# EAGLE design r202smt (EAGLE 6.6.0)
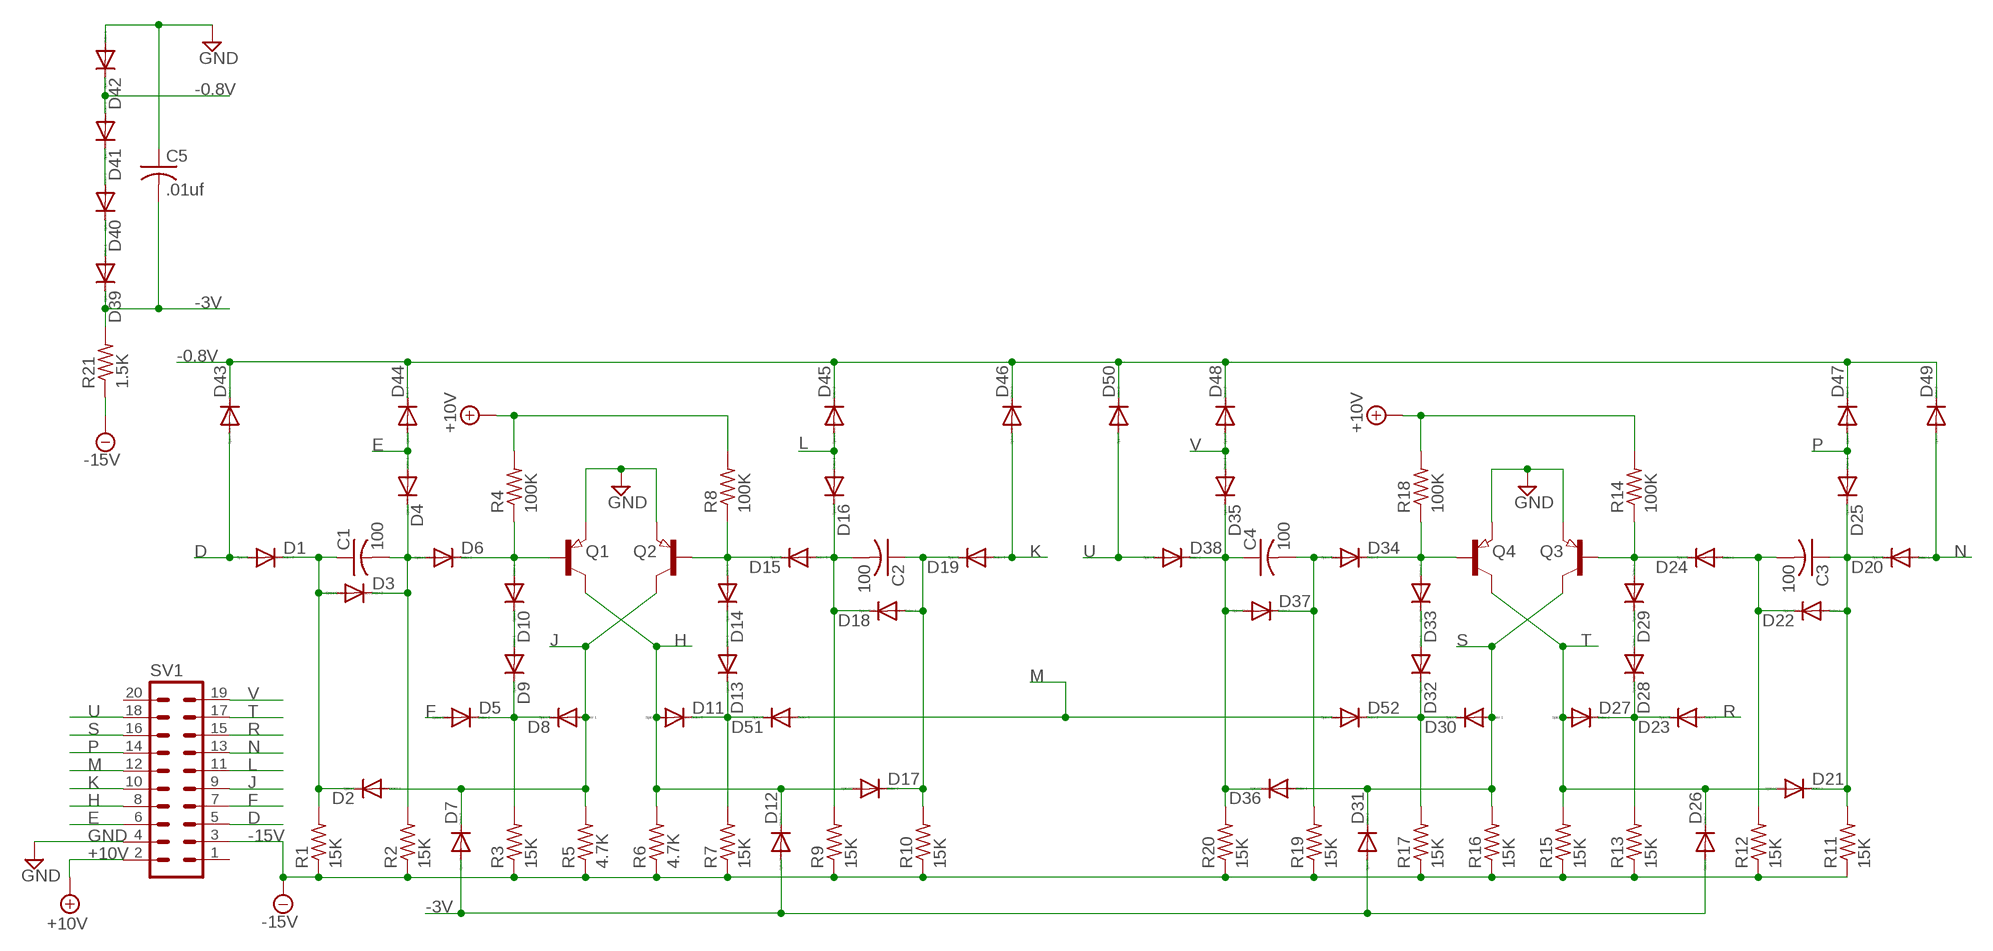
[diagram p0: schematic, sheet 1]

## Parts
C1  100  C-USC0603  [C0603]
C2  100  C-USC0603  [C0603]
C3  100  C-USC0603  [C0603]
C4  100  C-USC0603  [C0603]
C5  .01uf  C-USC1206  [C1206]
D1  DIODE-SOD110-W  [SOD110-W]
D2  DIODE-SOD110-W  [SOD110-W]
D3  DIODE-SOD110-W  [SOD110-W]
D4  DIODE-SOD110-W  [SOD110-W]
D5  DIODE-SOD110-W  [SOD110-W]
D6  DIODE-SOD110-W  [SOD110-W]
D7  DIODE-SOD110-W  [SOD110-W]
D8  DIODE-SOD110-W  [SOD110-W]
D9  DIODE-SOD110-W  [SOD110-W]
D10  DIODE-SOD110-W  [SOD110-W]
D11  DIODE-SOD110-W  [SOD110-W]
D12  DIODE-SOD110-W  [SOD110-W]
D13  DIODE-SOD110-W  [SOD110-W]
D14  DIODE-SOD110-W  [SOD110-W]
D15  DIODE-SOD110-W  [SOD110-W]
D16  DIODE-SOD110-W  [SOD110-W]
D17  DIODE-SOD110-W  [SOD110-W]
D18  DIODE-SOD110-W  [SOD110-W]
D19  DIODE-SOD110-W  [SOD110-W]
D20  DIODE-SOD110-W  [SOD110-W]
D21  DIODE-SOD110-W  [SOD110-W]
D22  DIODE-SOD110-W  [SOD110-W]
D23  DIODE-SOD110-W  [SOD110-W]
D24  DIODE-SOD110-W  [SOD110-W]
D25  DIODE-SOD110-W  [SOD110-W]
D26  DIODE-SOD110-W  [SOD110-W]
D27  DIODE-SOD110-W  [SOD110-W]
D28  DIODE-SOD110-W  [SOD110-W]
D29  DIODE-SOD110-W  [SOD110-W]
D30  DIODE-SOD110-W  [SOD110-W]
D31  DIODE-SOD110-W  [SOD110-W]
D32  DIODE-SOD110-W  [SOD110-W]
D33  DIODE-SOD110-W  [SOD110-W]
D34  DIODE-SOD110-W  [SOD110-W]
D35  DIODE-SOD110-W  [SOD110-W]
D36  DIODE-SOD110-W  [SOD110-W]
D37  DIODE-SOD110-W  [SOD110-W]
D38  DIODE-SOD110-W  [SOD110-W]
D39  DIODE-SOD110-W  [SOD110-W]
D40  DIODE-SOD110-W  [SOD110-W]
D41  DIODE-SOD110-W  [SOD110-W]
D42  DIODE-SOD110-W  [SOD110-W]
D43  DIODE-SOD110-W  [SOD110-W]
D44  DIODE-SOD110-W  [SOD110-W]
D45  DIODE-SOD110-W  [SOD110-W]
D46  DIODE-SOD110-W  [SOD110-W]
D47  DIODE-SOD110-W  [SOD110-W]
D48  DIODE-SOD110-W  [SOD110-W]
D49  DIODE-SOD110-W  [SOD110-W]
D50  DIODE-SOD110-W  [SOD110-W]
D51  DIODE-SOD110-W  [SOD110-W]
D52  DIODE-SOD110-W  [SOD110-W]
Q1  PNP-TRANSISTOR_SOT23  [SOT23]
Q2  PNP-TRANSISTOR_SOT23  [SOT23]
Q3  PNP-TRANSISTOR_SOT23  [SOT23]
Q4  PNP-TRANSISTOR_SOT23  [SOT23]
R1  15K  R-US_R0603  [R0603]
R2  15K  R-US_R0603  [R0603]
R3  15K  R-US_R0603  [R0603]
R4  100K  R-US_R0603  [R0603]
R5  4.7K  R-US_R0603  [R0603]
R6  4.7K  R-US_R0603  [R0603]
R7  15K  R-US_R0603  [R0603]
R8  100K  R-US_R0603  [R0603]
R9  15K  R-US_R0603  [R0603]
R10  15K  R-US_R0603  [R0603]
R11  15K  R-US_R0603  [R0603]
R12  15K  R-US_R0603  [R0603]
R13  15K  R-US_R0603  [R0603]
R14  100K  R-US_R0603  [R0603]
R15  15K  R-US_R0603  [R0603]
R16  15K  R-US_R0603  [R0603]
R17  15K  R-US_R0603  [R0603]
R18  100K  R-US_R0603  [R0603]
R19  15K  R-US_R0603  [R0603]
R20  15K  R-US_R0603  [R0603]
R21  1.5K  R-US_R1206  [R1206]
SV1  MA10-2W  [MA10-2W]

## Nets
+10V: R4.2 R8.2 R14.2 R18.2 SV1.2
-0.8V: D41.A D42.C D43.C D44.C D45.C D46.C D47.C D48.C D49.C D50.C
-3V: C5.2 D7.A D12.A D26.A D31.A D39.C R21.2
-15V: R1.1 R2.1 R3.1 R5.1 R6.1 R7.1 R9.1 R10.1 R11.1 R12.1 R13.1 R15.1 R16.1 R17.1 R19.1 R20.1 R21.1 SV1.3
D: D1.A D43.A SV1.5
E: D4.A D44.A SV1.6
F: D5.A SV1.7
GND: C5.1 D42.A Q1.2(E) Q2.2(E) Q3.2(E) Q4.2(E) SV1.4
H: D11.A D12.C D17.A Q1.3(C) R6.2 SV1.8
J: D2.A D7.C D8.A Q2.3(C) R5.2 SV1.9
K: D19.A D46.A SV1.10
L: D16.A D45.A SV1.11
M: D51.A D52.A SV1.12
N: D20.A D49.A SV1.13
N$1: C1.1 D1.C D2.C D3.A R1.2
N$2: D14.A D15.C Q2.1(B) R8.1
N$3: C1.2 D3.C D4.C D6.A R2.2
N$5: C3.2 D22.C D24.A R12.2
N$6: D6.C D10.A Q1.1(B) R4.1
N$7: D9.A D10.C
N$8: C3.1 D20.C D21.C D22.A D25.C R11.2
N$9: D5.C D8.C D9.C R3.2
N$10: D11.C D13.C D51.C R7.2
N$11: C4.1 D35.C D36.C D37.A D38.C R20.2
N$12: D13.A D14.C
N$13: C2.1 D17.C D18.A D19.C R10.2
N$14: C4.2 D34.A D37.C R19.2
N$15: C2.2 D15.A D16.C D18.C R9.2
N$17: D33.A D34.C Q4.1(B) R18.1
N$23: D32.A D33.C
N$24: D30.C D32.C D52.C R17.2
N$25: D23.C D27.C D28.C R13.2
N$26: D24.C D29.A Q3.1(B) R14.1
N$27: D28.A D29.C
N$30: D39.A D40.C
N$31: D40.A D41.C
P: D25.A D47.A SV1.14
R: D23.A SV1.15
S: D30.A D31.C D36.A Q3.3(C) R16.2 SV1.16
T: D21.A D26.C D27.A Q4.3(C) R15.2 SV1.17
U: D38.A D50.A SV1.18
V: D35.A D48.A SV1.19
Unconnected: SV1.1 SV1.20

## Library data of the parts
C1-C5 = rcl:C-US: CAPACITOR, American symbol
D1-D52 = diode:DIODE-: DIODE
Q1-Q4 = semicon-smd-ipc:PNP-TRANSISTOR_: PNP TRANSISTOR
R1-R21 = rcl:R-US_: RESISTOR, American symbol
SV1 = con-lstb:MA10-2W: PIN HEADER; OC_FARNELL: unknown; OC_NEWARK: unknown

## Board
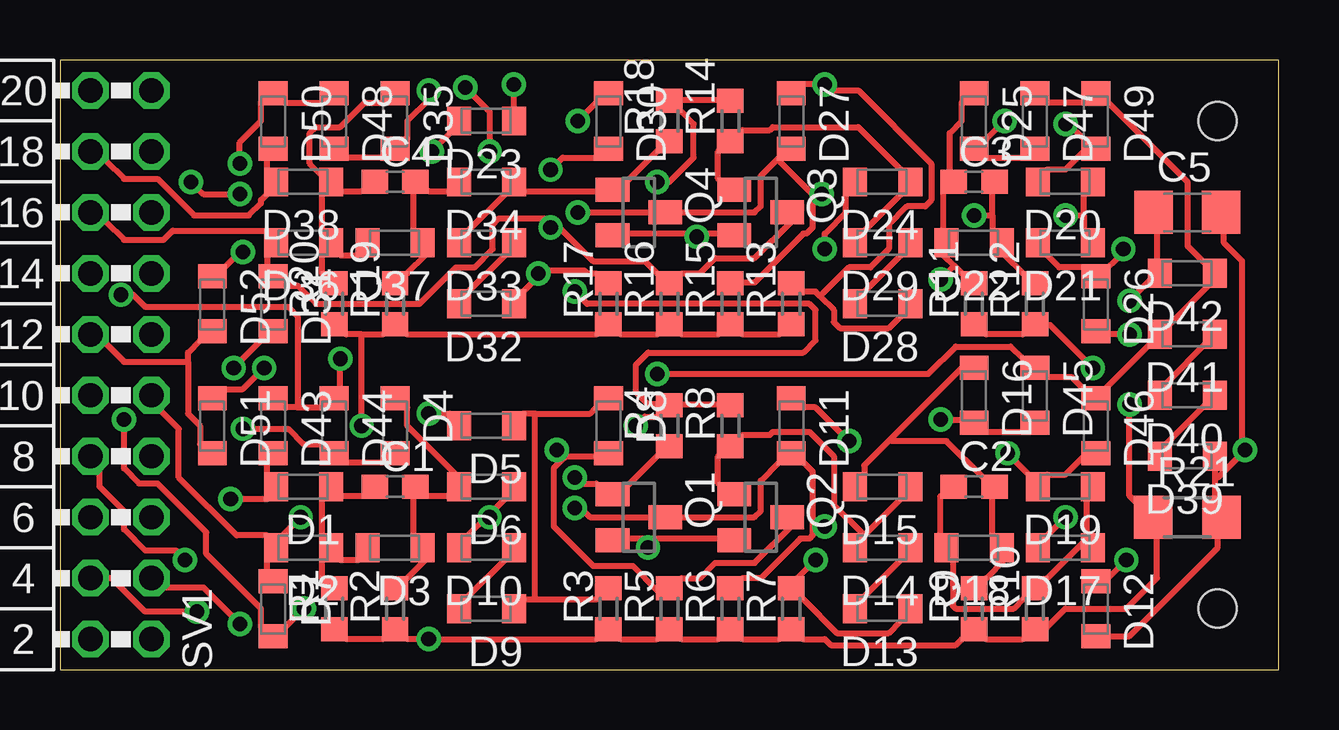
[diagram p1: board, top side]
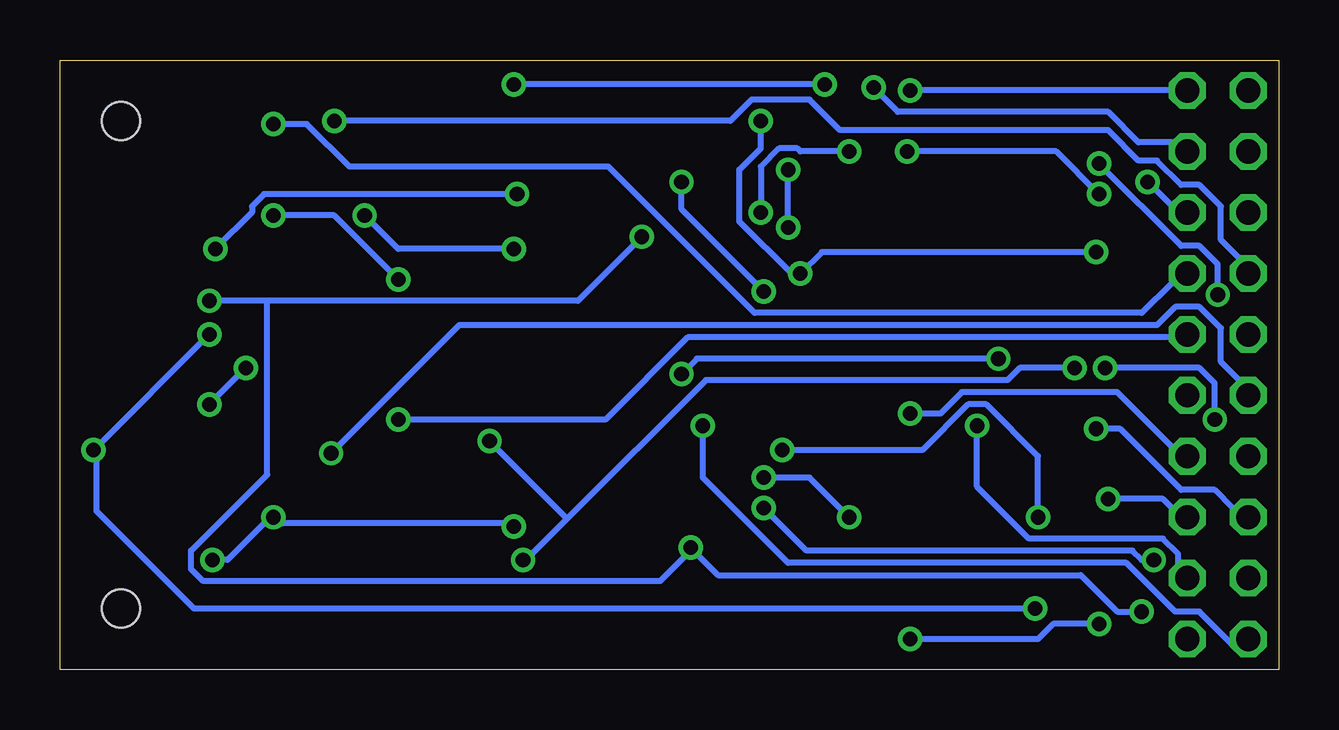
[diagram p2: board, bottom side, seen from below]

Size 50.8 x 25.4 mm. Coordinates in mm from the lower left corner, seen from the top.
Outline: 0,0 50.8,0 50.8,25.4 0,25.4 0,0
Copper layers (1*16): Top 0.035mm / dielectric 1.5mm / Bottom 0.035mm
Design rules "8mils": minimum track width 10mil, minimum drill 24mil, track to track 8mil, track to pad 8mil, pad to pad 8mil, via to via 8mil, smd to smd 8mil, copper to edge 20mil, drill to drill 10mil, minimum pad ring 10mil, minimum via ring 8mil, stop-mask expansion 0mil, vias tented up to drill 0mil, thermal gap 10mil
Holes 1.59 mm at 48.26,22.86 48.26,2.54

### Footprints (pad centres in the part's own frame; a part is rotated, then mirrored left to right if it is on the bottom)
C0603 = smd 1.1 x 1: 1 -0.85,0; 2 0.85,0
C1206 = smd 1.6 x 1.8: 1 -1.4,0; 2 1.4,0
SOD110-W = smd 1 x 1.2: A 1.15,0; C -1.15,0
SOT23 = smd 1 x 1.4: 1 -0.95,-1.1; 2 0.95,-1.1; 3 0,1.1
R0603 = smd 1 x 1.1: 1 -0.85,0; 2 0.85,0
R1206 = smd 1.6 x 1.803: 1 -1.422,0; 2 1.422,0
MA10-2W = drill 1.016 octagon: 1 -11.43,-1.27; 2 -11.43,1.27; 3 -8.89,-1.27; 4 -8.89,1.27; 5 -6.35,-1.27; 6 -6.35,1.27; 7 -3.81,-1.27; 8 -3.81,1.27; 9 -1.27,-1.27; 10 -1.27,1.27; 11 1.27,-1.27; 12 1.27,1.27; 13 3.81,-1.27; 14 3.81,1.27; 15 6.35,-1.27; 16 6.35,1.27; 17 8.89,-1.27; 18 8.89,1.27; 19 11.43,-1.27; 20 11.43,1.27

### Placement (x,y rotation side)
C1  13.97,7.62 0 top
C2  38.1,7.62 0 top
C3  38.1,20.32 0 top
C4  13.97,20.32 0 top
C5  46.99,19.05 0 top
D1  10.16,7.62 180 top
D2  10.16,5.08 180 top
D3  13.97,5.08 180 top
D4  13.97,10.16 270 top
D5  17.78,10.16 180 top
D6  17.78,7.62 180 top
D7  8.89,2.54 270 top
D8  22.86,10.16 270 top
D9  17.78,2.54 180 top
D10  17.78,5.08 180 top
D11  30.48,10.16 270 top
D12  43.18,2.54 270 top
D13  34.29,2.54 180 top
D14  34.29,5.08 180 top
D15  34.29,7.62 180 top
D16  38.1,11.43 270 top
D17  41.91,5.08 180 top
D18  38.1,5.08 180 top
D19  41.91,7.62 180 top
D20  41.91,20.32 180 top
D21  41.91,17.78 180 top
D22  38.1,17.78 180 top
D23  17.78,22.86 180 top
D24  34.29,20.32 180 top
D25  38.1,22.86 270 top
D26  43.18,15.24 270 top
D27  30.48,22.86 270 top
D28  34.29,15.24 180 top
D29  34.29,17.78 180 top
D30  22.86,22.86 270 top
D31  8.89,15.24 270 top
D32  17.78,15.24 180 top
D33  17.78,17.78 180 top
D34  17.78,20.32 180 top
D35  13.97,22.86 270 top
D36  10.16,17.78 180 top
D37  13.97,17.78 180 top
D38  10.16,20.32 180 top
D39  46.99,8.89 180 top
D40  46.99,11.43 180 top
D41  46.99,13.97 180 top
D42  46.99,16.51 180 top
D43  8.89,10.16 270 top
D44  11.43,10.16 270 top
D45  40.64,11.43 270 top
D46  43.18,10.16 270 top
D47  40.64,22.86 270 top
D48  11.43,22.86 270 top
D49  43.18,22.86 270 top
D50  8.89,22.86 270 top
D51  6.35,10.16 270 top
D52  6.35,15.24 270 top
Q1  24.13,6.35 270 top
Q2  29.21,6.35 270 top
Q3  29.21,19.05 270 top
Q4  24.13,19.05 270 top
R1  11.43,2.54 90 top
R2  13.97,2.54 90 top
R3  22.86,2.54 90 top
R4  25.4,10.16 90 top
R5  25.4,2.54 90 top
R6  27.94,2.54 90 top
R7  30.48,2.54 90 top
R8  27.94,10.16 90 top
R9  38.1,2.54 90 top
R10  40.64,2.54 90 top
R11  38.1,15.24 90 top
R12  40.64,15.24 90 top
R13  30.48,15.24 90 top
R14  27.94,22.86 90 top
R15  27.94,15.24 90 top
R16  25.4,15.24 90 top
R17  22.86,15.24 90 top
R18  25.4,22.86 90 top
R19  13.97,15.24 90 top
R20  11.43,15.24 90 top
R21  46.99,6.35 0 top
SV1  2.54,12.7 90 top

### Tracks (layer width: path | path; a pad name or v marks a point on that pad's centre or on a via)
+10V  (via drill 0.61)
  Top 0.254: R14.2 27.43,23.75 25.91,23.75 R18.2 25.91,23.24 26.42,22.73 26.42,21.34 25.4,20.32 v24.89,20.32 | R4.2 25.91,11.05 27.43,11.05 R8.2 | v24,10.16 24.38,10.54 24.89,10.54 R4.2 | v21.46,15.75 21.97,15.24 31.24,15.24 31.5,14.99 31.5,13.72 30.99,13.21 24.51,13.21 24,12.7 24,11.56 24.51,11.05 24.89,11.05 R4.2
  Bottom 0.254: v24,10.16 24,8 20.45,4.45 6.35,4.45 4.32,2.41 3.3,2.41 1.91,1.02 SV1.2 | v24.89,20.32 24.89,19.18 v21.46,15.75
-0.8V  (via drill 0.61)
  Top 0.254: 42.67,23.62 41.15,23.62 D47.C | D49.C 42.67,23.62 | D48.C 10.92,23.62 9.4,23.62 D50.C 8.38,23.62 8.38,22.86 7.49,21.97 v7.49,21.08 | 9.91,10.92 10.92,10.92 D44.C 11.68,11.68 v11.68,12.95 | 9.91,10.92 9.4,10.92 D43.C | v24.89,12.32 36.2,12.32 37.34,13.46 39.62,13.46 40.13,12.95 D45.C 41.15,12.19 42.16,12.19 42.67,11.68 D46.C D41.A 48.14,16.27 D42.C 46.99,17.66 46.99,20.32 43.69,23.62 42.67,23.62 | v2.54,15.62 3.05,15.62 3.56,15.11 9.53,15.11 9.91,14.73 9.91,10.92
  Bottom 0.254: v11.68,12.95 24.26,12.95 v24.89,12.32 | v7.49,21.08 4.06,17.65 3.3,17.65 2.54,16.89 v2.54,15.62
-3V  (via drill 0.61)
  Top 0.254: v2.67,10.41 2.67,8.38 3.3,7.75 4.06,7.75 6.1,5.71 6.1,4.83 8.38,2.54 8.38,1.78 D7.A 9.02,1.4 v10.16,2.54 | v7.24,12.57 8.38,13.72 D31.A | D12.A 44.57,1.39 48.26,5.08 48.26,6.2 R21.2 48.14,6.62 48.14,8 | D39.C 48.14,8 | v44.58,13.97 43.18,13.97 D26.A | 48.14,8 48.26,8 v49.4,9.14 49.28,9.14 49.28,17.02 48.51,17.78 48.51,19.05 C5.2
  Bottom 0.254: v2.67,10.41 2.67,11.94 3.3,12.57 v7.24,12.57 | v44.58,13.97 v49.4,9.14 49.28,9.14 49.28,6.6 45.21,2.54 v10.16,2.54
-15V  (via drill 0.61)
  Top 0.254: 12.57,13.97 13.46,13.97 R19.1 14.48,13.97 22.35,13.97 R17.1 23.37,13.97 24.89,13.97 R16.1 25.91,13.97 27.43,13.97 R15.1 28.45,13.97 29.97,13.97 R13.1 | 12.57,13.97 11.94,13.97 R20.1 | v12.57,10.16 12.57,13.97 | R1.1 11.94,1.27 13.46,1.27 R2.1 14.48,1.27 v15.37,1.27 22.35,1.27 R3.1 23.37,1.27 24.89,1.27 R5.1 25.91,1.27 27.43,1.27 R6.1 28.45,1.27 29.97,1.27 R7.1 30.99,1.27 31.88,1.27 32.13,1.02 37.34,1.02 37.59,1.27 R9.1 38.61,1.27 40.13,1.27 R10.1 41.06,1.69 41.91,2.54 44.45,2.54 45.72,3.81 45.72,6.2 R21.1 45.47,6.35 44.58,7.24 v44.58,11.05 | R11.1 38.61,13.97 40.13,13.97 R12.1 40.64,14.35 41.27,14.35 v43.05,12.57 | v7.49,1.91 5.97,3.43 4.45,3.43 SV1.3
  Bottom 0.254: v12.57,10.16 12.57,7.62 10.41,5.46 4.83,5.46 4.19,4.83 4.19,4.45 SV1.3 | v7.49,1.91 9.4,1.91 10.03,1.27 v15.37,1.27 | v44.58,11.05 v43.05,12.57
D  (via drill 0.61)
  Top 0.254: D43.A 8.64,8.64 8.64,8.13 D1.A 8.64,7.11 v7.11,7.11
  Bottom 0.254: v7.11,7.11 4.83,7.11 4.45,6.73 SV1.5
E  (via drill 0.61)
  Top 0.254: D4.A 13.46,8.64 11.94,8.64 D44.A 10.92,9.4 10.16,9.4 9.53,10.03 v7.62,10.03
  Bottom 0.254: v7.62,10.03 6.6,10.03 4.06,7.49 2.67,7.49 1.91,6.73 SV1.6
F  (via drill 0.61)
  Top 0.254: v15.37,10.67 16.26,10.67 D5.A
  Bottom 0.254: v15.37,10.67 14.1,10.67 13.21,11.56 6.73,11.56 4.45,9.27 SV1.7
GND  (via drill 0.61)
  Top 0.254: C5.1 45.59,19.18 45.72,19.05 45.72,16.63 D42.A 45.72,16.51 v44.58,15.37 | 26.54,18.16 28.07,18.16 Q3.2 | 26.54,18.16 23.11,18.16 Q4.2 | 26.54,18.16 v26.54,18.03 | 24.51,5.46 28.07,5.46 Q2.2 | 24.51,5.46 23.11,5.46 Q1.2 | SV1.4 2.16,3.81 3.56,2.41 v5.71,2.41 | 24.51,5.46 v24.51,5.08
  Bottom 0.254: 42.16,15.37 29.21,15.37 v26.54,18.03 | 42.16,15.37 v44.58,15.37 | v5.71,2.41 6.73,2.41 8.26,3.94 23.37,3.94 v24.51,5.08 24.51,4.95 25.78,3.68 44.83,3.68 45.34,4.19 45.34,4.95 42.16,8.13 42.16,15.37
H  (via drill 0.61)
  Top 0.254: v41.91,6.35 41.15,5.59 D17.A | 31.37,5.97 31.37,8.26 30.99,8.64 D11.A 29.97,8.64 29.21,7.87 29.21,6.6 28.96,6.35 Q1.3 22.1,6.35 21.72,6.73 v21.46,6.73 | 31.37,5.97 31.37,5.59 31.24,5.46 30.86,5.46 29.21,3.81 28.45,3.81 R6.2 | 31.37,5.97 v31.88,5.97 | v5.21,4.57 4.83,4.95 3.56,4.95 2.67,5.84 2.67,6.6 1.65,7.62 1.65,8.26 SV1.8 | v44.45,4.57 43.69,3.81 43.18,3.81 D12.C
  Bottom 0.254: v31.88,5.97 32,6.1 41.53,6.1 v41.91,6.35 42.04,6.35 43.81,4.57 v44.45,4.57 | v5.21,4.57 5.71,4.57 6.1,4.95 19.68,4.95 v21.46,6.73
J  (via drill 0.61)
  Top 0.254: Q2.3 30.48,5.97 28.96,4.45 27.3,4.45 26.67,3.81 25.91,3.81 R5.2 24.89,3.3 23.88,4.32 22.23,4.32 20.57,5.97 20.57,8.38 21.02,8.83 | 21.02,8.83 21.08,8.89 22.35,8.89 D8.A | D7.C 8.64,4.06 8.64,4.57 D2.A | D2.A 8.64,5.59 7.37,5.59 4.95,8 4.95,10.03 4.19,10.79 SV1.9 | v10.03,6.35 9.27,5.59 D2.A | v20.7,9.14 21.02,8.83
  Bottom 0.254: v20.7,9.14 14.86,9.14 12.95,11.05 12.19,11.05 10.03,8.89 v10.03,6.35
K  (via drill 0.61)
  Top 0.254: D46.A 42.67,8.89 41.91,8.13 41.15,8.13 D19.A 40.39,8.13 v39.5,9.02
  Bottom 0.254: v39.5,9.02 34.16,14.35 5.08,14.35 4.32,15.11 3.3,15.11 2.41,14.22 2.41,12.83 1.65,12.06 SV1.10
L  (via drill 0.61)
  Top 0.254: D45.A 40.13,9.91 38.61,9.91 D16.A 37.59,10.41 v36.7,10.41
  Bottom 0.254: v36.7,10.41 28.07,10.41 24.64,13.84 4.45,13.84 SV1.11
M
  Top 0.254: 5.33,12.83 5.33,13.21 5.84,13.72 D52.A | 5.33,12.83 5.33,10.67 5.84,10.16 5.84,9.4 D51.A | 5.33,12.83 2.67,12.83 1.91,13.59 SV1.12
N  (via drill 0.61)
  Top 0.254: D20.A 41.15,20.83 41.91,20.83 42.67,21.59 D49.A 42.67,22.1 42.04,22.73 v41.91,22.73
  Bottom 0.254: v41.91,22.73 40.51,22.73 38.73,20.95 27.94,20.95 21.84,14.86 5.71,14.86 4.45,16.13 SV1.13
N$1
  Top 0.254: C1.1 12.57,7.24 11.68,7.24 D1.C 10.92,7.11 10.92,5.59 D2.C | R1.2 10.92,3.81 10.92,4.57 D2.C | D3.A 12.45,4.57 11.68,4.57 D2.C
N$2
  Top 0.254: Q2.1 27.43,7.75 27.43,8.89 R8.1 28.45,9.78 29.59,9.78 29.72,9.91 31.24,9.91 32.26,8.89 32.26,6.86 33.53,5.59 | 33.53,5.59 35.05,7.11 D15.C | 33.53,5.59 D14.A
N$3
  Top 0.254: R2.2 14.48,3.81 15.24,4.57 D3.C 14.73,5.59 14.73,7.24 C1.2 15.37,7.24 16.26,7.24 D6.A 16.51,8.13 14.48,10.16 14.48,10.92 D4.C
N$5  (via drill 0.61)
  Top 0.254: R12.2 40.13,16.51 39.37,17.27 D22.C 38.86,18.29 38.86,18.92 | 38.86,18.92 38.86,19.94 C3.2 | v31.88,17.53 31.88,18.16 32.77,19.05 32.77,19.81 D24.A | v38.1,18.92 38.86,18.92
  Bottom 0.254: v31.88,17.53 36.7,17.53 v38.1,18.92
N$6  (via drill 0.61)
  Top 0.254: R4.1 24.89,8.89 23.62,7.62 Q1.1 22.35,7.75 21.72,7.75 v21.46,8 | 17.84,6.41 18.54,7.11 D6.C | 17.84,6.41 17.02,5.59 D10.A | 17.84,6.41 v17.91,6.35
  Bottom 0.254: v21.46,8 19.56,8 v17.91,6.35
N$7
  Top 0.254: D9.A 17.02,3.05 18.54,4.57 D10.C
N$8  (via drill 0.61)
  Top 0.254: 42.67,18.92 42.67,19.81 D20.C | 42.67,18.92 42.67,18.29 D21.C | 37.27,16.83 36.83,17.27 D22.A 36.83,18.29 36.83,19.94 C3.1 37.08,20.7 37.08,22.35 37.59,22.86 37.59,23.62 D25.C | 37.27,16.83 37.59,16.51 R11.2 | v41.91,18.92 42.67,18.92 | v36.7,16.26 37.27,16.83
  Bottom 0.254: v41.91,18.92 39.37,18.92 v36.7,16.26
N$9
  Top 0.254: 19.81,2.92 19.3,2.92 D9.C | 19.81,2.92 22.35,2.92 R3.2 | 19.81,10.67 22.1,10.67 22.35,10.92 D8.C | 19.81,10.67 19.3,10.67 D5.C | 19.81,2.92 19.81,10.67
N$10  (via drill 0.61)
  Top 0.254: D13.C 35.05,2.03 34.54,1.52 32.38,1.52 30.99,2.92 R7.2 30.73,3.81 v31.5,4.57 | v8.51,12.57 7.62,11.68 6.86,11.68 D51.C | v32.89,9.53 31.5,10.92 30.99,10.92 D11.C
  Bottom 0.254: v8.51,12.57 10.79,12.57 11.3,12.06 23.88,12.06 29.65,6.29 | 29.65,6.29 31.37,4.57 v31.5,4.57 | 29.65,6.29 v32.89,9.53
N$11
  Top 0.254: R20.2 10.92,16.51 10.92,17.27 D36.C | D37.A 12.45,17.27 11.68,17.27 D36.C | C4.1 12.57,19.94 11.68,19.94 D38.C | D35.C 13.46,23.62 12.7,23.62 11.68,22.61 10.67,22.61 10.41,22.35 10.41,21.08 10.92,20.57 D38.C | D36.C 10.92,18.29 10.92,19.81 D38.C
N$12
  Top 0.254: D13.A 33.53,3.05 35.05,4.57 D14.C
N$13
  Top 0.254: C2.1 36.7,7.24 36.7,5.59 D18.A 37.21,4.57 37.21,2.67 37.34,2.54 39.75,2.54 40.13,2.92 R10.2 41.15,3.81 42.67,5.33 D17.C 42.8,5.59 42.8,7.11 D19.C
N$14
  Top 0.254: D34.A 16.26,19.94 15.37,19.94 C4.2 14.73,19.94 14.73,18.29 D37.C 15.24,17.27 14.48,16.51 R19.2
N$15
  Top 0.254: R9.2 38.61,3.81 39.37,4.57 D18.C 38.86,5.59 38.86,7.24 C2.2 38.48,8 36.96,9.53 34.67,9.53 34.61,9.59 | 34.61,9.59 37.59,12.57 D16.C | 34.61,9.59 33.53,8.51 33.53,8.13 D15.A
N$17
  Top 0.254: R18.1 24.89,21.59 23.62,20.32 Q4.1 22.35,19.94 19.3,19.94 D34.C 18.54,19.81 17.02,18.29 D33.A
N$23
  Top 0.254: D32.A 17.02,15.75 18.54,17.27 D33.C
N$24  (via drill 0.61)
  Top 0.254: 20,16.45 19.3,15.75 D32.C | 20,16.45 20.19,16.64 21.84,16.64 21.97,16.51 22.35,16.51 R17.2 | v7.62,17.4 7.49,17.4 6.86,16.76 D52.C | v19.94,16.51 20,16.45 | v21.59,22.86 22.35,23.62 D30.C
  Bottom 0.254: v7.62,17.4 19.05,17.4 v19.94,16.51 20.32,16.51 22.48,18.67 22.48,20.83 21.59,21.72 v21.59,22.86
N$25  (via drill 0.61)
  Top 0.254: 31.69,15.56 32.26,14.99 32.26,14.48 32.51,14.22 34.54,14.22 35.05,14.73 D28.C | 31.69,15.56 31.5,15.75 30.99,15.75 R13.2 | v18.92,24.38 18.92,23.37 D23.C | D27.C 30.99,24.38 v31.88,24.38 32.26,24.13 33.27,24.13 36.32,21.08 36.32,19.56 36.07,19.3 35.31,19.3 34.54,18.54 34.54,17.53 33.78,16.76 32.89,16.76 31.69,15.56
  Bottom 0.254: v18.92,24.38 v31.88,24.38
N$26
  Top 0.254: Q3.1 27.43,20.45 27.43,21.59 R14.1 28.45,22.48 29.59,22.48 29.72,22.61 33.27,22.61 35.05,20.83 D24.C 35.05,19.81 33.53,18.29 D29.A
N$27
  Top 0.254: D28.A 33.53,15.75 35.05,17.27 D29.C
N$30
  Top 0.254: D39.A 45.84,9.13 D40.C
N$31
  Top 0.254: D40.A 45.84,11.67 D41.C
P  (via drill 0.61)
  Top 0.254: D47.A 40.13,21.34 38.61,21.34 D25.A 38.61,22.1 v39.37,22.86
  Bottom 0.254: v39.37,22.86 22.86,22.86 21.97,23.75 19.56,23.75 18.29,22.48 7.11,22.48 5.84,21.21 5.08,21.21 4.06,20.19 3.3,20.19 2.41,19.3 2.41,17.91 1.65,17.14 SV1.14
R  (via drill 0.61)
  Top 0.254: v15.49,21.59 16.26,22.35 D23.A | v7.49,19.81 5.97,19.81 v5.46,20.32
  Bottom 0.254: v15.49,21.59 9.27,21.59 v7.49,19.81 | v5.46,20.32 4.45,19.3 SV1.15
S  (via drill 0.61)
  Top 0.254: SV1.16 1.91,18.67 2.67,17.91 4.32,17.91 4.7,18.29 8.64,18.29 D36.A 8.64,17.27 8.64,16.76 D31.C 9.4,16 9.91,16 10.67,15.24 14.99,15.24 16.51,16.76 17.27,16.76 18.03,17.53 18.03,18.54 18.29,18.8 20.19,18.8 v20.45,18.41 20.83,18.41 22.23,17.02 24.38,17.02 24.89,16.51 R16.2 25.91,16.51 26.67,16.51 27.3,17.14 28.96,17.14 30.48,18.67 Q3.3 | v20.45,20.83 20.95,21.34 22.35,21.34 D30.A
  Bottom 0.254: v20.45,18.41 v20.45,20.83
T  (via drill 0.61)
  Top 0.254: D21.A 41.15,17.27 41.66,16.76 42.67,16.76 D26.C 43.31,16.38 44.32,17.4 v44.32,17.53 | 29.91,21.27 29.21,20.57 29.21,19.3 28.96,19.05 Q4.3 v21.59,19.05 | 29.91,21.27 29.97,21.34 D27.A | v16.89,24.26 17.91,23.24 v17.91,21.59 | 31.37,19.81 31.37,18.41 31.11,18.16 30.99,18.16 28.96,16.13 27.94,16.13 R15.2 | 29.91,21.27 31.37,19.81 | 31.37,19.81 v31.75,19.81
  Bottom 0.254: v16.89,24.26 15.88,23.24 7.11,23.24 5.84,21.97 4.45,21.97 SV1.17 | v17.91,21.59 19.94,21.59 20.07,21.72 20.83,21.72 21.59,20.95 v21.59,19.05 | v44.32,17.53 42.8,19.05 42.8,19.3 42.29,19.81 v31.75,19.81
U
  Top 0.254: D50.A 8.64,21.34 8.64,20.83 D38.A 8.64,19.81 8.38,19.56 8.38,19.43 7.87,18.92 5.59,18.92 4.06,20.45 2.67,20.45 1.91,21.21 SV1.18
V  (via drill 0.61)
  Top 0.254: D48.A 11.94,21.34 13.46,21.34 D35.A 14.48,22.1 14.48,22.86 15.37,23.75 v15.37,24.13
  Bottom 0.254: SV1.19 v15.37,24.13